# Altium schematic sheet Power.SchDoc
size A4; SheetNumber: 2; SheetTotal: 7
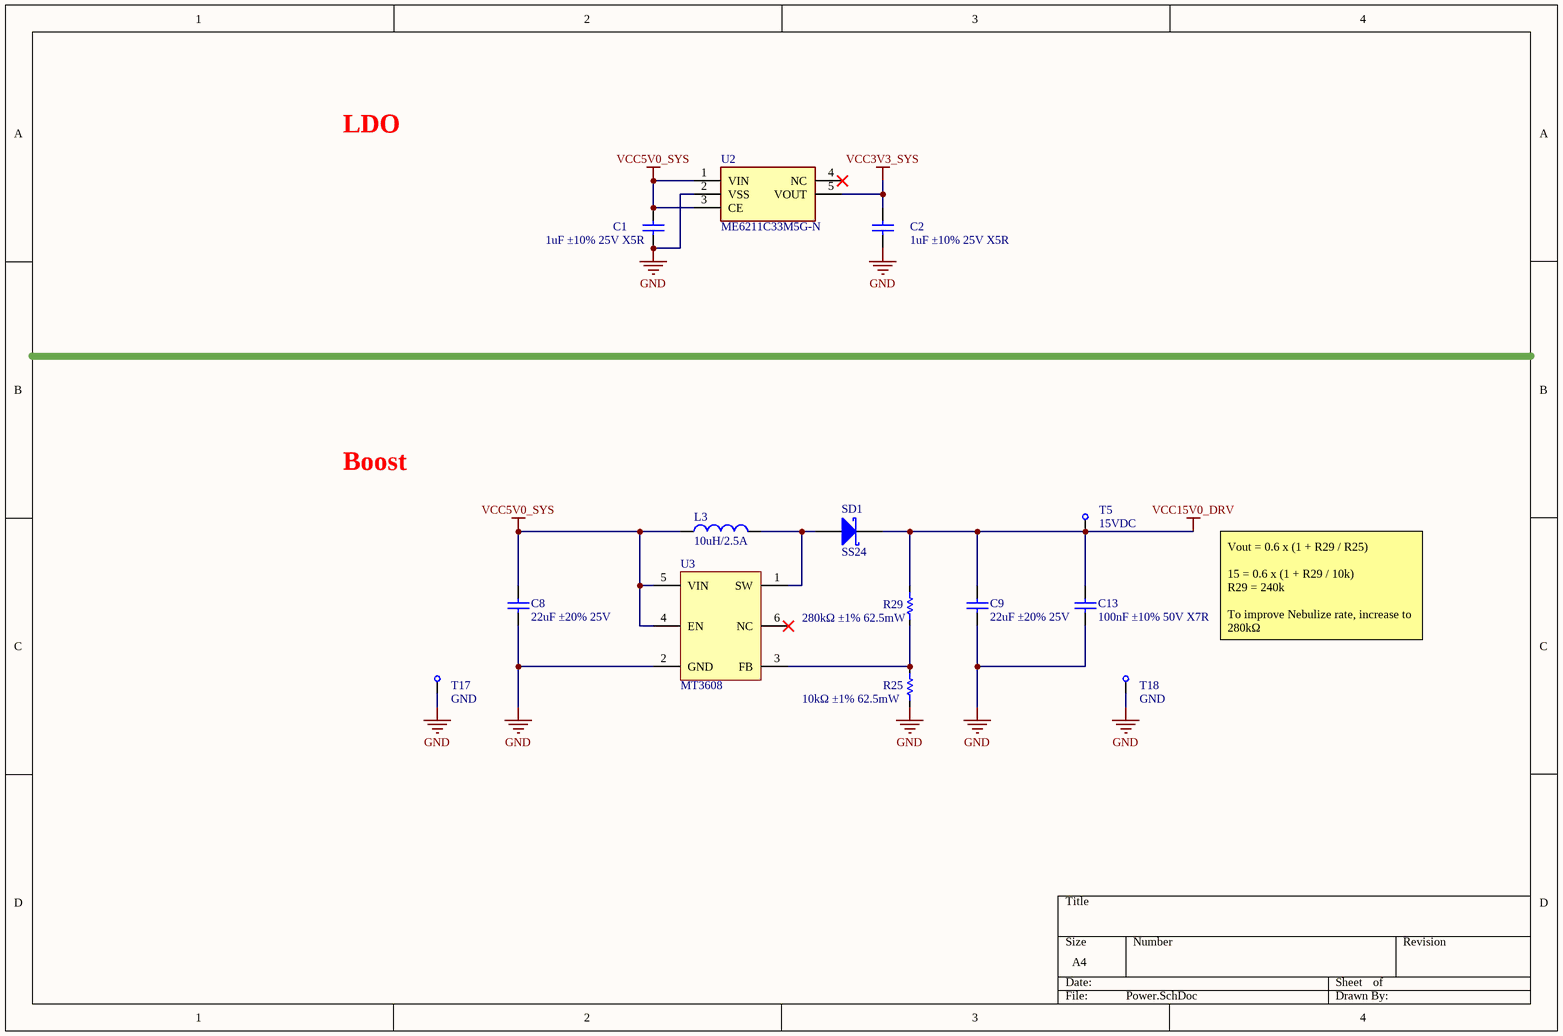
[diagram p0: Power.SchDoc]

## Parts
C1  1uF ±10% 25V X5R  [C0402]
C2  1uF ±10% 25V X5R  [C0402]
C8  22uF ±20% 25V  [C0805]
C9  22uF ±20% 25V  [C0805]
C13  100nF ±10% 50V X7R  [C0402]
L3  10uH/2.5A  [SP0502]
R25  10kΩ ±1% 62.5mW  [R0402]
R29  280kΩ ±1% 62.5mW  [R0402]
SD1  SS24  [SMA-403D]
T5  15VDC  [TP-SIP-1-Small1]
T17  GND  [TP-SIP-1-Small1]
T18  GND  [TP-SIP-1-Small1]
U2  ME6211C33M5G-N  [SOT95P270X145-5N]
U3  MT3608  [SOT95P280X110-6N]

## Nets
GND: C1.1 C2.1 C8.1 C9.1 C13.2 R25.1 T17.1 T18.1 U2.2(VSS) U3.2(GND)
VCC3V3_SYS: C2.2 U2.5(VOUT)
VCC5V0_SYS: C1.2 C8.2 L3.1 U2.1(VIN) U2.3(CE) U3.4(EN) U3.5(VIN)
VCC15V0_DRV: C9.2 C13.1 R29.2 SD1.2(K) T5.1
NetL3_2: L3.2 SD1.1(A) U3.1(SW)
NetR25_2: R25.2 R29.1 U3.3(FB)

Not connected (* = marked no-connect by the designer): U2 4(NC)*; U3 6(NC)*

## Notes on the sheet
- LDO
- Boost
- Vout = 0.6 x (1 + R29 / R25)
  15 = 0.6 x (1 + R29 / 10k)
  R29 = 240k
  To improve Nebulize rate, increase to 280kΩ

## Library data of the parts
C1 C2 = Cap: CL05A475KP5NRNC; Published: 8-Jun-2000; LatestRevisionDate: 17-Jul-2002; LatestRevisionNote: Re-released for DXP Platform.; PackageReference: RAD-0.3; Publisher: Altium Limited; PackageDescription: Radial Cap, Thru-Hole; 2 Leads; 0.3 in Pin Spacing
C8 C9 = C0805: CL21A226MAQNNNE; Published: 8-Jun-2000; LatestRevisionDate: 17-Jul-2002; LatestRevisionNote: Re-released for DXP Platform.; PackageReference: RAD-0.3; Publisher: Altium Limited; PackageDescription: Radial Cap, Thru-Hole; 2 Leads; 0.3 in Pin Spacing
C13 = Cap Semi: CL05B104KB54PNC; Value: 100pF; Published: 8-Jun-2000; LatestRevisionDate: 29-May-2009; LatestRevisionNote: IPC-7351 Footprint Added.; PackageReference: C1206; Publisher: Altium Limited; PackageDescription: Chip Capacitor
L3 = Inductor: SWPA6028S100MT; Code_IEC: 1005; Value: 10uH; Published: 8-Jun-2000; LatestRevisionDate: 29-May-2009; LatestRevisionNote: IPC-7351 Footprint Added.; PackageReference: 0402-A; Publisher: Altium Limited; PackageDescription: Chip Inductor; Code_JEITA: 0402
R25 = R0402: 0402WGF1002TCE; Published: 8-Jun-2000; LatestRevisionDate: 17-Jul-2002; LatestRevisionNote: Re-released for DXP Platform.; PackageReference: AXIAL-0.3; Publisher: Altium Limited; PackageDescription: Axial Device, Thru-Hole; 2 Leads; 0.3 in Pin Spacing
R29 = R0402: 0402WGF2803TCE; Published: 8-Jun-2000; LatestRevisionDate: 17-Jul-2002; LatestRevisionNote: Re-released for DXP Platform.; PackageReference: AXIAL-0.3; Publisher: Altium Limited; PackageDescription: Axial Device, Thru-Hole; 2 Leads; 0.3 in Pin Spacing
SD1 = D Schottky: C50645; Published: 8-Jun-2000; LatestRevisionDate: 17-Jul-2002; LatestRevisionNote: Re-released for DXP Platform.; PackageReference: SMB; Publisher: Altium Limited; PackageDescription: DO-214-AA/SMB; 2 C-Bend Leads; Body 5.3 x 3.6 mm, inc. leads (LxW); Code_JEDEC: DO-214-AA
T5 T17 T18 = TP-SIP-1-Small
U2 = ME6211C33M5G-N: ME6211C33M5G-N / LDO 3.3V; Manufacturer_Name: Microne; Datasheet Link: https://datasheet.lcsc.com/szlcsc/1811131510_MICRONE-Nanjing-Micro-One-Elec-ME6211C33M5G-N_C82942.pdf; Height: 1.45mm; Manufacturer_Part_Number: ME6211C33M5G-N